# Altium schematic sheet Main schem.SchDoc
size A3; DocumentNumber: 1; SheetNumber: 1; SheetTotal: 7
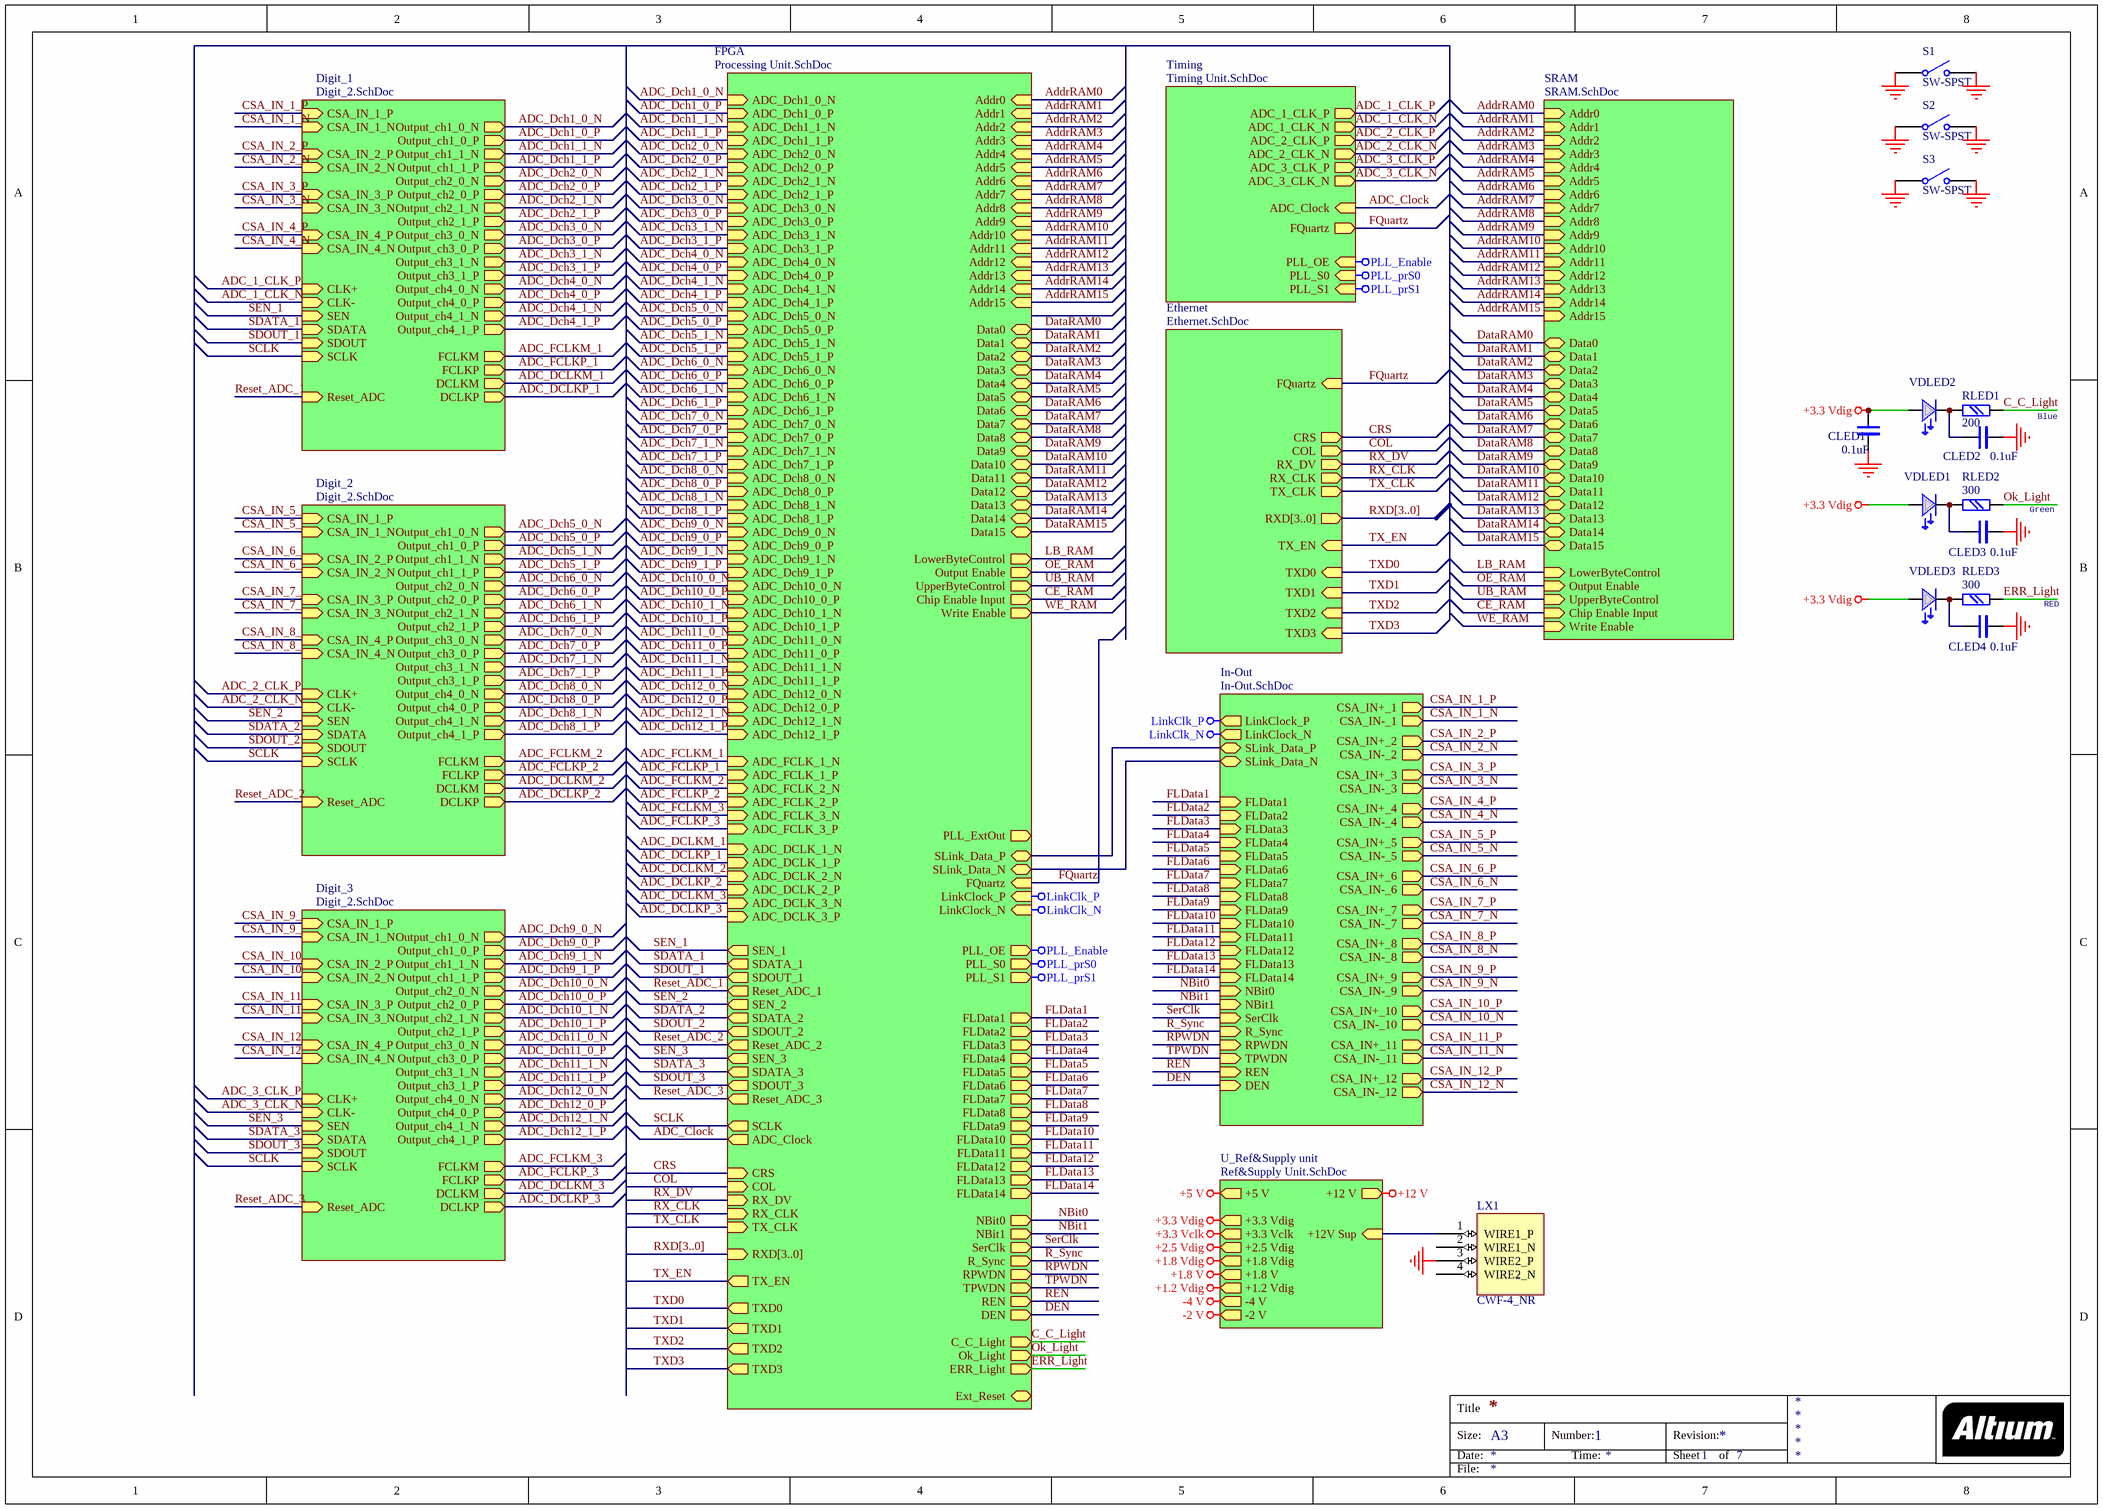
[diagram p0: Main schem.SchDoc]

## Parts
CLED1  0.1uF  [chip0805]
CLED2  0.1uF  [chip0603]
CLED3  0.1uF  [chip0603]
CLED4  0.1uF  [chip0603]
LX1  CWF-4_NR  [CWF-4R]
RLED1  200  [chip0603]
RLED2  300  [chip0603]
RLED3  300  [chip0603]
S1  SW-SPST  [SPST-2]
S2  SW-SPST  [SPST-2]
S3  SW-SPST  [SPST-2]
VDLED1  LED  [LED0805]  (value not drawn)
VDLED2  LED  [LED1206]  (value not drawn)
VDLED3  LED  [LED1206]  (value not drawn)

## Sub-sheets
Digit_1 = Digit_2.SchDoc: Output_ch1_0_P (out), Output_ch1_0_N (out), Output_ch1_1_P (out), Output_ch1_1_N (out), CLK+ (in), Output_ch2_0_N (out), Output_ch2_0_P (out), Output_ch2_1_N (out), Output_ch2_1_P (out), Output_ch3_0_N (out), Output_ch3_0_P (out), Output_ch3_1_N (out), Output_ch3_1_P (out), Output_ch4_0_N (out), Output_ch4_0_P (out), Output_ch4_1_N (out), Output_ch4_1_P (out), CLK- (in), CSA_IN_1_P (in), CSA_IN_1_N (in), CSA_IN_2_P (in), CSA_IN_2_N (in), CSA_IN_3_P (in), CSA_IN_3_N (in), CSA_IN_4_P (in), CSA_IN_4_N (in), SEN (in), SDATA (in), SCLK (in), SDOUT (in), Reset_ADC (in), FCLKM (out), FCLKP (out), DCLKM (out), DCLKP (out)
Digit_2 = Digit_2.SchDoc: Output_ch1_0_P (out), Output_ch1_0_N (out), Output_ch1_1_P (out), Output_ch1_1_N (out), CLK+ (in), Output_ch2_0_N (out), Output_ch2_0_P (out), Output_ch2_1_N (out), Output_ch2_1_P (out), Output_ch3_0_N (out), Output_ch3_0_P (out), Output_ch3_1_N (out), Output_ch3_1_P (out), Output_ch4_0_N (out), Output_ch4_0_P (out), Output_ch4_1_N (out), Output_ch4_1_P (out), CLK- (in), CSA_IN_1_P (in), CSA_IN_1_N (in), CSA_IN_2_P (in), CSA_IN_2_N (in), CSA_IN_3_P (in), CSA_IN_3_N (in), CSA_IN_4_P (in), CSA_IN_4_N (in), SEN (in), SDATA (in), SCLK (in), SDOUT (in), Reset_ADC (in), FCLKM (out), FCLKP (out), DCLKM (out), DCLKP (out)
Digit_3 = Digit_2.SchDoc: Output_ch1_0_P (out), Output_ch1_0_N (out), Output_ch1_1_P (out), Output_ch1_1_N (out), CLK+ (in), Output_ch2_0_N (out), Output_ch2_0_P (out), Output_ch2_1_N (out), Output_ch2_1_P (out), Output_ch3_0_N (out), Output_ch3_0_P (out), Output_ch3_1_N (out), Output_ch3_1_P (out), Output_ch4_0_N (out), Output_ch4_0_P (out), Output_ch4_1_N (out), Output_ch4_1_P (out), CLK- (in), CSA_IN_1_P (in), CSA_IN_1_N (in), CSA_IN_2_P (in), CSA_IN_2_N (in), CSA_IN_3_P (in), CSA_IN_3_N (in), CSA_IN_4_P (in), CSA_IN_4_N (in), SEN (in), SDATA (in), SCLK (in), SDOUT (in), Reset_ADC (in), FCLKM (out), FCLKP (out), DCLKM (out), DCLKP (out)
Ethernet = Ethernet.SchDoc: COL (out), TX_EN (in), TX_CLK (out), RX_CLK (out), RX_DV (out), TXD0 (in), RXD[3..0] (out), CRS (out), FQuartz (in), TXD1 (in), TXD2 (in), TXD3 (in)
FPGA = Processing Unit.SchDoc: ADC_Dch1_0_P (in), ADC_Dch1_0_N (in), ERR_Light (out), Ok_Light (out), C_C_Light (out), LinkClock_P (in), SLink_Data_P (bidir), SLink_Data_N (bidir), PLL_ExtOut (out), FQuartz (in), Ext_Reset, PLL_OE (out), PLL_S0 (out), PLL_S1 (out), FLData1 (out), FLData2 (out), FLData3 (out), FLData4 (out), FLData5 (out), FLData6 (out), FLData7 (out), FLData8 (out), NBit0 (out), NBit1 (out), SerClk (out), R_Sync (out), RPWDN (out), FLData9 (out), FLData10 (out), TPWDN (out), REN (out), DEN (out), SEN_1 (out), SDATA_1 (out), SCLK (out), SDOUT_1 (out), ADC_Dch1_1_P (in), ADC_Dch1_1_N (in), ADC_Dch2_0_P (in), ADC_Dch2_0_N (in), ADC_Dch2_1_P (in), ADC_Dch2_1_N (in), ADC_Dch3_0_P (in), ADC_Dch3_0_N (in), ADC_Dch3_1_P (in), ADC_Dch3_1_N (in), ADC_Dch4_0_P (in), ADC_Dch4_0_N (in), ADC_Dch4_1_P (in), ADC_Dch4_1_N (in), ADC_Dch5_0_P (in), ADC_Dch5_0_N (in), ADC_Dch5_1_P (in), ADC_Dch5_1_N (in), ADC_Dch6_0_P (in), ADC_Dch6_0_N (in), ADC_Dch6_1_P (in), ADC_Dch6_1_N (in), ADC_Dch7_0_P (in), ADC_Dch7_0_N (in), ADC_Dch7_1_P (in), ADC_Dch7_1_N (in), ADC_Dch8_0_P (in), ADC_Dch8_0_N (in), ADC_Dch8_1_P (in), ADC_Dch8_1_N (in), ADC_Dch9_0_P (in), ADC_Dch9_0_N (in), ADC_Dch9_1_P (in), ADC_Dch9_1_N (in), ADC_Dch10_0_P (in), ADC_Dch10_0_N (in), ADC_Dch10_1_P (in), ADC_Dch10_1_N (in), ADC_Dch11_0_P (in), ADC_Dch11_0_N (in), ADC_Dch11_1_P (in), ADC_Dch11_1_N (in), ADC_Dch12_0_P (in), ADC_Dch12_0_N (in), ADC_Dch12_1_P (in), ADC_Dch12_1_N (in), FLData11 (out), FLData12 (out), FLData13 (out), FLData14 (out), COL (in), TX_EN (out), TX_CLK (in), RX_CLK (in), RX_DV (in), RXD[3..0] (in), CRS (in), ADC_FCLK_1_P (in), ADC_FCLK_1_N (in), ADC_FCLK_2_P (in), ADC_FCLK_2_N (in), ADC_FCLK_3_P (in), ADC_FCLK_3_N (in), TXD0 (out), TXD1 (out), TXD2 (out), TXD3 (out), LinkClock_N (in), Addr0 (in), Addr1 (in), Addr2 (in), Addr3 (in), Addr4 (in), Addr5 (in), Addr6 (in), Addr7 (in), Addr8 (in), Addr9 (in), Addr10 (in), Addr11 (in), Addr12 (in), Addr13 (in), Addr14 (in), Addr15 (in), Data0 (bidir), Data1 (bidir), Data2 (bidir), Data3 (bidir), Data4 (bidir), Data5 (bidir), Data6 (bidir), Data7 (bidir), Data8 (bidir), Data9 (bidir), Data10 (bidir), Data11 (bidir), Data12 (bidir), Data13 (bidir), Data14 (bidir), Data15 (bidir), LowerByteControl (out), Output Enable (out), UpperByteControl (out), Chip Enable Input (out), Write Enable (out), SEN_2 (out), SDATA_2 (out), SDOUT_2 (out), SEN_3 (out), SDATA_3 (out), SDOUT_3 (out), ADC_DCLK_1_P (in), ADC_DCLK_1_N (in), ADC_DCLK_2_P (in), ADC_DCLK_2_N (in), ADC_DCLK_3_P (in), ADC_DCLK_3_N (in), ADC_Clock (out), Reset_ADC_1 (out), Reset_ADC_2 (out), Reset_ADC_3 (out)
In-Out = In-Out.SchDoc: SLink_Data_N (bidir), SLink_Data_P (bidir), LinkClock_P (out), FLData1 (in), FLData2 (in), FLData3 (in), FLData4 (in), FLData5 (in), FLData6 (in), FLData7 (in), FLData8 (in), NBit0 (in), NBit1 (in), SerClk (in), R_Sync (in), RPWDN (in), CSA_IN+_1 (out), CSA_IN-_1 (out), CSA_IN+_2 (out), CSA_IN-_2 (out), CSA_IN+_3 (out), CSA_IN-_3 (out), CSA_IN+_4 (out), CSA_IN-_4 (out), CSA_IN+_5 (out), CSA_IN-_5 (out), CSA_IN+_6 (out), CSA_IN-_6 (out), FLData9 (in), FLData10 (in), TPWDN (in), REN (in), DEN (in), CSA_IN+_7 (out), CSA_IN-_7 (out), CSA_IN+_8 (out), CSA_IN-_8 (out), CSA_IN+_9 (out), CSA_IN-_9 (out), CSA_IN+_10 (out), CSA_IN-_10 (out), CSA_IN+_11 (out), CSA_IN-_11 (out), CSA_IN+_12 (out), CSA_IN-_12 (out), FLData11 (in), FLData12 (in), FLData13 (in), FLData14 (in), LinkClock_N (out)
SRAM = SRAM.SchDoc: Addr0 (in), Addr1 (in), Addr2 (in), Addr3 (in), Addr4 (in), Addr5 (in), Addr6 (in), Addr7 (in), Addr8 (in), Addr9 (in), Addr10 (in), Addr11 (in), Addr12 (in), Addr13 (in), Addr14 (in), Addr15 (in), Data0 (bidir), Data1 (bidir), Data2 (bidir), Data3 (bidir), Data4 (bidir), Data5 (bidir), Data6 (bidir), Data7 (bidir), Data8 (bidir), Data9 (bidir), Data10 (bidir), Data11 (bidir), Data12 (bidir), Data13 (bidir), Data14 (bidir), Data15 (bidir), LowerByteControl (in), Output Enable (in), UpperByteControl (in), Chip Enable Input (in), Write Enable (in)
Timing = Timing Unit.SchDoc: FQuartz (out), PLL_OE (in), PLL_S0 (in), PLL_S1 (in), ADC_1_CLK_P (out), ADC_1_CLK_N (out), ADC_2_CLK_N (out), ADC_2_CLK_P (out), ADC_3_CLK_P (out), ADC_3_CLK_N (out), ADC_Clock (in)
U_Ref&Supply unit = Ref&Supply Unit.SchDoc: +12V Sup (in), +5 V (out), +3.3 Vdig (out), +3.3 Vclk (out), +2.5 Vdig (out), +1.8 Vdig (out), +1.8 V (out), +1.2 Vdig (out), -4 V (out), -2 V (out), +12 V (out)

## Nets
+1.2 Vdig: sheet U_Ref&Supply unit/+1.2 Vdig
+1.8 V: sheet U_Ref&Supply unit/+1.8 V
+1.8 Vdig: sheet U_Ref&Supply unit/+1.8 Vdig
+2.5 Vdig: sheet U_Ref&Supply unit/+2.5 Vdig
+3.3 Vclk: sheet U_Ref&Supply unit/+3.3 Vclk
+3.3 Vdig: CLED1.1 VDLED1.ANOD VDLED2.ANOD VDLED3.ANOD ; sheet U_Ref&Supply unit/+3.3 Vdig
+5 V: sheet U_Ref&Supply unit/+5 V
+12 V: sheet U_Ref&Supply unit/+12 V
-2 V: sheet U_Ref&Supply unit/-2 V
-4 V: sheet U_Ref&Supply unit/-4 V
GND: CLED1.2 CLED2.2 CLED3.2 CLED4.2 LX1.3(WIRE2_P) S1.1(COMMON) S1.2(NO) S2.1(COMMON) S2.2(NO) S3.1(COMMON) S3.2(NO)
LinkClk_N: sheet FPGA/LinkClock_N, sheet In-Out/LinkClock_N
LinkClk_P: sheet FPGA/LinkClock_P, sheet In-Out/LinkClock_P
PLL_Enable: sheet FPGA/PLL_OE, sheet Timing/PLL_OE
PLL_prS0: sheet FPGA/PLL_S0, sheet Timing/PLL_S0
PLL_prS1: sheet FPGA/PLL_S1, sheet Timing/PLL_S1
ADC_1_CLK_N: sheet Digit_1/CLK-, sheet Timing/ADC_1_CLK_N
ADC_1_CLK_P: sheet Digit_1/CLK+, sheet Timing/ADC_1_CLK_P
ADC_2_CLK_N: sheet Timing/ADC_2_CLK_N, sheet Digit_2/CLK-
ADC_2_CLK_P: sheet Timing/ADC_2_CLK_P, sheet Digit_2/CLK+
ADC_3_CLK_N: sheet Timing/ADC_3_CLK_N, sheet Digit_3/CLK-
ADC_3_CLK_P: sheet Timing/ADC_3_CLK_P, sheet Digit_3/CLK+
ADC_Clock: sheet FPGA/ADC_Clock, sheet Timing/ADC_Clock
ADC_Dch1_0_N: sheet Digit_1/Output_ch1_0_N, sheet FPGA/ADC_Dch1_0_N
ADC_Dch1_0_P: sheet Digit_1/Output_ch1_0_P, sheet FPGA/ADC_Dch1_0_P
ADC_Dch1_1_N: sheet Digit_1/Output_ch1_1_N, sheet FPGA/ADC_Dch1_1_N
ADC_Dch1_1_P: sheet Digit_1/Output_ch1_1_P, sheet FPGA/ADC_Dch1_1_P
ADC_Dch2_0_N: sheet Digit_1/Output_ch2_0_N, sheet FPGA/ADC_Dch2_0_N
ADC_Dch2_0_P: sheet Digit_1/Output_ch2_0_P, sheet FPGA/ADC_Dch2_0_P
ADC_Dch2_1_N: sheet Digit_1/Output_ch2_1_N, sheet FPGA/ADC_Dch2_1_N
ADC_Dch2_1_P: sheet Digit_1/Output_ch2_1_P, sheet FPGA/ADC_Dch2_1_P
ADC_Dch3_0_N: sheet Digit_1/Output_ch3_0_N, sheet FPGA/ADC_Dch3_0_N
ADC_Dch3_0_P: sheet Digit_1/Output_ch3_0_P, sheet FPGA/ADC_Dch3_0_P
ADC_Dch3_1_N: sheet Digit_1/Output_ch3_1_N, sheet FPGA/ADC_Dch3_1_N
ADC_Dch3_1_P: sheet Digit_1/Output_ch3_1_P, sheet FPGA/ADC_Dch3_1_P
ADC_Dch4_0_N: sheet Digit_1/Output_ch4_0_N, sheet FPGA/ADC_Dch4_0_N
ADC_Dch4_0_P: sheet Digit_1/Output_ch4_0_P, sheet FPGA/ADC_Dch4_0_P
ADC_Dch4_1_N: sheet Digit_1/Output_ch4_1_N, sheet FPGA/ADC_Dch4_1_N
ADC_Dch4_1_P: sheet Digit_1/Output_ch4_1_P, sheet FPGA/ADC_Dch4_1_P
ADC_Dch5_0_N: sheet FPGA/ADC_Dch5_0_N, sheet Digit_2/Output_ch1_0_N
ADC_Dch5_0_P: sheet FPGA/ADC_Dch5_0_P, sheet Digit_2/Output_ch1_0_P
ADC_Dch5_1_N: sheet FPGA/ADC_Dch5_1_N, sheet Digit_2/Output_ch1_1_N
ADC_Dch5_1_P: sheet FPGA/ADC_Dch5_1_P, sheet Digit_2/Output_ch1_1_P
ADC_Dch6_0_N: sheet FPGA/ADC_Dch6_0_N, sheet Digit_2/Output_ch2_0_N
ADC_Dch6_0_P: sheet FPGA/ADC_Dch6_0_P, sheet Digit_2/Output_ch2_0_P
ADC_Dch6_1_N: sheet FPGA/ADC_Dch6_1_N, sheet Digit_2/Output_ch2_1_N
ADC_Dch6_1_P: sheet FPGA/ADC_Dch6_1_P, sheet Digit_2/Output_ch2_1_P
ADC_Dch7_0_N: sheet FPGA/ADC_Dch7_0_N, sheet Digit_2/Output_ch3_0_N
ADC_Dch7_0_P: sheet FPGA/ADC_Dch7_0_P, sheet Digit_2/Output_ch3_0_P
ADC_Dch7_1_N: sheet FPGA/ADC_Dch7_1_N, sheet Digit_2/Output_ch3_1_N
ADC_Dch7_1_P: sheet FPGA/ADC_Dch7_1_P, sheet Digit_2/Output_ch3_1_P
ADC_Dch8_0_N: sheet FPGA/ADC_Dch8_0_N, sheet Digit_2/Output_ch4_0_N
ADC_Dch8_0_P: sheet FPGA/ADC_Dch8_0_P, sheet Digit_2/Output_ch4_0_P
ADC_Dch8_1_N: sheet FPGA/ADC_Dch8_1_N, sheet Digit_2/Output_ch4_1_N
ADC_Dch8_1_P: sheet FPGA/ADC_Dch8_1_P, sheet Digit_2/Output_ch4_1_P
ADC_Dch9_0_N: sheet FPGA/ADC_Dch9_0_N, sheet Digit_3/Output_ch1_0_N
ADC_Dch9_0_P: sheet FPGA/ADC_Dch9_0_P, sheet Digit_3/Output_ch1_0_P
ADC_Dch9_1_N: sheet FPGA/ADC_Dch9_1_N, sheet Digit_3/Output_ch1_1_N
ADC_Dch9_1_P: sheet FPGA/ADC_Dch9_1_P, sheet Digit_3/Output_ch1_1_P
ADC_Dch10_0_N: sheet FPGA/ADC_Dch10_0_N, sheet Digit_3/Output_ch2_0_N
ADC_Dch10_0_P: sheet FPGA/ADC_Dch10_0_P, sheet Digit_3/Output_ch2_0_P
ADC_Dch10_1_N: sheet FPGA/ADC_Dch10_1_N, sheet Digit_3/Output_ch2_1_N
ADC_Dch10_1_P: sheet FPGA/ADC_Dch10_1_P, sheet Digit_3/Output_ch2_1_P
ADC_Dch11_0_N: sheet FPGA/ADC_Dch11_0_N, sheet Digit_3/Output_ch3_0_N
ADC_Dch11_0_P: sheet FPGA/ADC_Dch11_0_P, sheet Digit_3/Output_ch3_0_P
ADC_Dch11_1_N: sheet FPGA/ADC_Dch11_1_N, sheet Digit_3/Output_ch3_1_N
ADC_Dch11_1_P: sheet FPGA/ADC_Dch11_1_P, sheet Digit_3/Output_ch3_1_P
ADC_Dch12_0_N: sheet FPGA/ADC_Dch12_0_N, sheet Digit_3/Output_ch4_0_N
ADC_Dch12_0_P: sheet FPGA/ADC_Dch12_0_P, sheet Digit_3/Output_ch4_0_P
ADC_Dch12_1_N: sheet FPGA/ADC_Dch12_1_N, sheet Digit_3/Output_ch4_1_N
ADC_Dch12_1_P: sheet FPGA/ADC_Dch12_1_P, sheet Digit_3/Output_ch4_1_P
ADC_DCLKM_1: sheet Digit_1/DCLKM, sheet FPGA/ADC_DCLK_1_N
ADC_DCLKM_2: sheet FPGA/ADC_DCLK_2_N, sheet Digit_2/DCLKM
ADC_DCLKM_3: sheet FPGA/ADC_DCLK_3_N, sheet Digit_3/DCLKM
ADC_DCLKP_1: sheet Digit_1/DCLKP, sheet FPGA/ADC_DCLK_1_P
ADC_DCLKP_2: sheet FPGA/ADC_DCLK_2_P, sheet Digit_2/DCLKP
ADC_DCLKP_3: sheet FPGA/ADC_DCLK_3_P, sheet Digit_3/DCLKP
ADC_FCLKM_1: sheet Digit_1/FCLKM, sheet FPGA/ADC_FCLK_1_N
ADC_FCLKM_2: sheet FPGA/ADC_FCLK_2_N, sheet Digit_2/FCLKM
ADC_FCLKM_3: sheet FPGA/ADC_FCLK_3_N, sheet Digit_3/FCLKM
ADC_FCLKP_1: sheet Digit_1/FCLKP, sheet FPGA/ADC_FCLK_1_P
ADC_FCLKP_2: sheet FPGA/ADC_FCLK_2_P, sheet Digit_2/FCLKP
ADC_FCLKP_3: sheet FPGA/ADC_FCLK_3_P, sheet Digit_3/FCLKP
AddrRAM0: sheet FPGA/Addr0, sheet SRAM/Addr0
AddrRAM1: sheet FPGA/Addr1, sheet SRAM/Addr1
AddrRAM2: sheet FPGA/Addr2, sheet SRAM/Addr2
AddrRAM3: sheet FPGA/Addr3, sheet SRAM/Addr3
AddrRAM4: sheet FPGA/Addr4, sheet SRAM/Addr4
AddrRAM5: sheet FPGA/Addr5, sheet SRAM/Addr5
AddrRAM6: sheet FPGA/Addr6, sheet SRAM/Addr6
AddrRAM7: sheet FPGA/Addr7, sheet SRAM/Addr7
AddrRAM8: sheet FPGA/Addr8, sheet SRAM/Addr8
AddrRAM9: sheet FPGA/Addr9, sheet SRAM/Addr9
AddrRAM10: sheet FPGA/Addr10, sheet SRAM/Addr10
AddrRAM11: sheet FPGA/Addr11, sheet SRAM/Addr11
AddrRAM12: sheet FPGA/Addr12, sheet SRAM/Addr12
AddrRAM13: sheet FPGA/Addr13, sheet SRAM/Addr13
AddrRAM14: sheet FPGA/Addr14, sheet SRAM/Addr14
AddrRAM15: sheet FPGA/Addr15, sheet SRAM/Addr15
C_C_Light: RLED1.2 ; sheet FPGA/C_C_Light
CE_RAM: sheet FPGA/Chip Enable Input, sheet SRAM/Chip Enable Input
COL: sheet FPGA/COL, sheet Ethernet/COL
CRS: sheet FPGA/CRS, sheet Ethernet/CRS
CSA_IN_1_N: sheet Digit_1/CSA_IN_1_N, sheet In-Out/CSA_IN-_1
CSA_IN_1_P: sheet Digit_1/CSA_IN_1_P, sheet In-Out/CSA_IN+_1
CSA_IN_2_N: sheet Digit_1/CSA_IN_2_N, sheet In-Out/CSA_IN-_2
CSA_IN_2_P: sheet Digit_1/CSA_IN_2_P, sheet In-Out/CSA_IN+_2
CSA_IN_3_N: sheet Digit_1/CSA_IN_3_N, sheet In-Out/CSA_IN-_3
CSA_IN_3_P: sheet Digit_1/CSA_IN_3_P, sheet In-Out/CSA_IN+_3
CSA_IN_4_N: sheet Digit_1/CSA_IN_4_N, sheet In-Out/CSA_IN-_4
CSA_IN_4_P: sheet Digit_1/CSA_IN_4_P, sheet In-Out/CSA_IN+_4
CSA_IN_5_N: sheet In-Out/CSA_IN-_5, sheet Digit_2/CSA_IN_1_N
CSA_IN_5_P: sheet In-Out/CSA_IN+_5, sheet Digit_2/CSA_IN_1_P
CSA_IN_6_N: sheet In-Out/CSA_IN-_6, sheet Digit_2/CSA_IN_2_N
CSA_IN_6_P: sheet In-Out/CSA_IN+_6, sheet Digit_2/CSA_IN_2_P
CSA_IN_7_N: sheet In-Out/CSA_IN-_7, sheet Digit_2/CSA_IN_3_N
CSA_IN_7_P: sheet In-Out/CSA_IN+_7, sheet Digit_2/CSA_IN_3_P
CSA_IN_8_N: sheet In-Out/CSA_IN-_8, sheet Digit_2/CSA_IN_4_N
CSA_IN_8_P: sheet In-Out/CSA_IN+_8, sheet Digit_2/CSA_IN_4_P
CSA_IN_9_N: sheet In-Out/CSA_IN-_9, sheet Digit_3/CSA_IN_1_N
CSA_IN_9_P: sheet In-Out/CSA_IN+_9, sheet Digit_3/CSA_IN_1_P
CSA_IN_10_N: sheet In-Out/CSA_IN-_10, sheet Digit_3/CSA_IN_2_N
CSA_IN_10_P: sheet In-Out/CSA_IN+_10, sheet Digit_3/CSA_IN_2_P
CSA_IN_11_N: sheet In-Out/CSA_IN-_11, sheet Digit_3/CSA_IN_3_N
CSA_IN_11_P: sheet In-Out/CSA_IN+_11, sheet Digit_3/CSA_IN_3_P
CSA_IN_12_N: sheet In-Out/CSA_IN-_12, sheet Digit_3/CSA_IN_4_N
CSA_IN_12_P: sheet In-Out/CSA_IN+_12, sheet Digit_3/CSA_IN_4_P
DataRAM0: sheet FPGA/Data0, sheet SRAM/Data0
DataRAM1: sheet FPGA/Data1, sheet SRAM/Data1
DataRAM2: sheet FPGA/Data2, sheet SRAM/Data2
DataRAM3: sheet FPGA/Data3, sheet SRAM/Data3
DataRAM4: sheet FPGA/Data4, sheet SRAM/Data4
DataRAM5: sheet FPGA/Data5, sheet SRAM/Data5
DataRAM6: sheet FPGA/Data6, sheet SRAM/Data6
DataRAM7: sheet FPGA/Data7, sheet SRAM/Data7
DataRAM8: sheet FPGA/Data8, sheet SRAM/Data8
DataRAM9: sheet FPGA/Data9, sheet SRAM/Data9
DataRAM10: sheet FPGA/Data10, sheet SRAM/Data10
DataRAM11: sheet FPGA/Data11, sheet SRAM/Data11
DataRAM12: sheet FPGA/Data12, sheet SRAM/Data12
DataRAM13: sheet FPGA/Data13, sheet SRAM/Data13
DataRAM14: sheet FPGA/Data14, sheet SRAM/Data14
DataRAM15: sheet FPGA/Data15, sheet SRAM/Data15
DEN: sheet FPGA/DEN, sheet In-Out/DEN
ERR_Light: RLED3.2 ; sheet FPGA/ERR_Light
FLData1: sheet FPGA/FLData1, sheet In-Out/FLData1
FLData2: sheet FPGA/FLData2, sheet In-Out/FLData2
FLData3: sheet FPGA/FLData3, sheet In-Out/FLData3
FLData4: sheet FPGA/FLData4, sheet In-Out/FLData4
FLData5: sheet FPGA/FLData5, sheet In-Out/FLData5
FLData6: sheet FPGA/FLData6, sheet In-Out/FLData6
FLData7: sheet FPGA/FLData7, sheet In-Out/FLData7
FLData8: sheet FPGA/FLData8, sheet In-Out/FLData8
FLData9: sheet FPGA/FLData9, sheet In-Out/FLData9
FLData10: sheet FPGA/FLData10, sheet In-Out/FLData10
FLData11: sheet FPGA/FLData11, sheet In-Out/FLData11
FLData12: sheet FPGA/FLData12, sheet In-Out/FLData12
FLData13: sheet FPGA/FLData13, sheet In-Out/FLData13
FLData14: sheet FPGA/FLData14, sheet In-Out/FLData14
FQuartz: sheet FPGA/FQuartz, sheet Timing/FQuartz, sheet Ethernet/FQuartz
LB_RAM: sheet FPGA/LowerByteControl, sheet SRAM/LowerByteControl
NBit0: sheet FPGA/NBit0, sheet In-Out/NBit0
NBit1: sheet FPGA/NBit1, sheet In-Out/NBit1
OE_RAM: sheet FPGA/Output Enable, sheet SRAM/Output Enable
Ok_Light: RLED2.2 ; sheet FPGA/Ok_Light
R_Sync: sheet FPGA/R_Sync, sheet In-Out/R_Sync
REN: sheet FPGA/REN, sheet In-Out/REN
Reset_ADC_1: sheet Digit_1/Reset_ADC, sheet FPGA/Reset_ADC_1
Reset_ADC_2: sheet FPGA/Reset_ADC_2, sheet Digit_2/Reset_ADC
Reset_ADC_3: sheet FPGA/Reset_ADC_3, sheet Digit_3/Reset_ADC
RPWDN: sheet FPGA/RPWDN, sheet In-Out/RPWDN
RX_CLK: sheet FPGA/RX_CLK, sheet Ethernet/RX_CLK
RX_DV: sheet FPGA/RX_DV, sheet Ethernet/RX_DV
SCLK: sheet Digit_1/SCLK, sheet FPGA/SCLK, sheet Digit_2/SCLK, sheet Digit_3/SCLK
SDATA_1: sheet Digit_1/SDATA, sheet FPGA/SDATA_1
SDATA_2: sheet FPGA/SDATA_2, sheet Digit_2/SDATA
SDATA_3: sheet FPGA/SDATA_3, sheet Digit_3/SDATA
SDOUT_1: sheet Digit_1/SDOUT, sheet FPGA/SDOUT_1
SDOUT_2: sheet FPGA/SDOUT_2, sheet Digit_2/SDOUT
SDOUT_3: sheet FPGA/SDOUT_3, sheet Digit_3/SDOUT
SEN_1: sheet Digit_1/SEN, sheet FPGA/SEN_1
SEN_2: sheet FPGA/SEN_2, sheet Digit_2/SEN
SEN_3: sheet FPGA/SEN_3, sheet Digit_3/SEN
SerClk: sheet FPGA/SerClk, sheet In-Out/SerClk
TPWDN: sheet FPGA/TPWDN, sheet In-Out/TPWDN
TX_CLK: sheet FPGA/TX_CLK, sheet Ethernet/TX_CLK
TX_EN: sheet FPGA/TX_EN, sheet Ethernet/TX_EN
TXD0: sheet FPGA/TXD0, sheet Ethernet/TXD0
TXD1: sheet FPGA/TXD1, sheet Ethernet/TXD1
TXD2: sheet FPGA/TXD2, sheet Ethernet/TXD2
TXD3: sheet FPGA/TXD3, sheet Ethernet/TXD3
UB_RAM: sheet FPGA/UpperByteControl, sheet SRAM/UpperByteControl
WE_RAM: sheet FPGA/Write Enable, sheet SRAM/Write Enable
NetCLED2_1: CLED2.1 RLED1.1 VDLED2.CATH
NetCLED3_1: CLED3.1 RLED2.1 VDLED1.CATH
NetCLED4_1: CLED4.1 RLED3.1 VDLED3.CATH
NetLX1_1: LX1.1(WIRE1_P) ; sheet U_Ref&Supply unit/+12V Sup
(unnamed): sheet FPGA/SLink_Data_P, sheet In-Out/SLink_Data_P
(unnamed): sheet FPGA/SLink_Data_N, sheet In-Out/SLink_Data_N

Not connected (* = marked no-connect by the designer): LX1 2(WIRE1_N) 4(WIRE2_N)

## Buses and harness runs
bus RXD[3..0] = sheet Ethernet/RXD[3..0]
bus RXD[3..0] = sheet FPGA/RXD[3..0]

## Notes on the sheet
- Blue
- Green
- RED
- Title
- Size:
- Date:
- A3
- Number:
- Time:
- Revision:
- Sheet
- of
- File:

## Library data of the parts
CLED1-CLED4 = C: Text Field1: 20; Text Field2: 10
LX1 = CWF-4-R
RLED1-RLED3 = R: Text Field1: 20; Text Field2: 20
S1-S3 = SW-SPST: Single-Pole, Single-Throw Switch; Published: 24-Mar-1999; LatestRevisionDate: 17-Jul-2002; LatestRevisionNote: Re-released for DXP Platform.; PackageReference: SPST-2; Publisher: Altium Limited; PackageDescription: Switch; 2 Leads
VDLED1-VDLED3 = AL307: Text Field1: 10; Text Field2: 30